# Altium project CWs_RFLink.PrjPcb
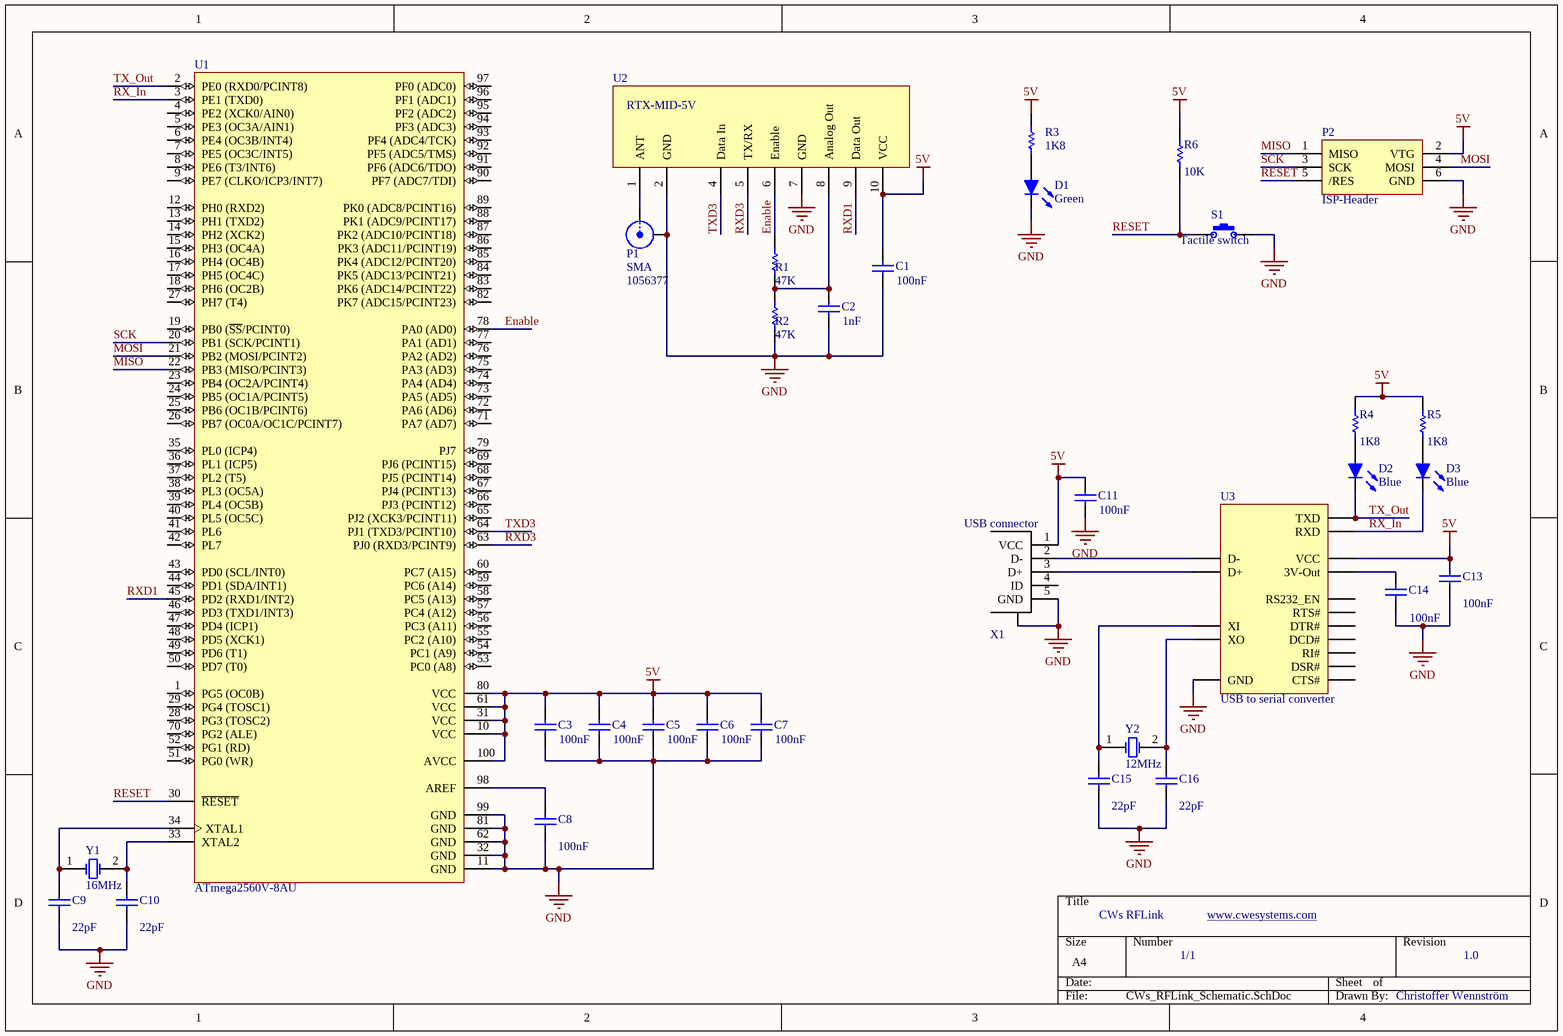
[diagram p0: CWs_RFLink_Schematic.SchDoc]
1 sheet, 33 parts. Net scope: global (net labels, ports and power ports of the same name join across sheets).
Board file: CWs_RFLink_PCB.PcbDoc

## Sheet CWs_RFLink_Schematic.SchDoc
size A4

### Parts
C1  value 100nF  [C-0805]  (hidden comment: Cap)
C2  value 1nF  [C-0805]  (hidden comment: Cap)
C3  value 100nF  [C-0805]  (hidden comment: Cap)
C4  value 100nF  [C-0805]  (hidden comment: Cap)
C5  value 100nF  [C-0805]  (hidden comment: Cap)
C6  value 100nF  [C-0805]  (hidden comment: Cap)
C7  value 100nF  [C-0805]  (hidden comment: Cap)
C8  value 100nF  [C-0805]  (hidden comment: Cap)
C9  value 22pF  [C-0805]  (hidden comment: Cap)
C10  value 22pF  [C-0805]  (hidden comment: Cap)
C11  value 100nF  [C-0805]  (hidden comment: Cap)
C13  value 100nF  [C-0805]  (hidden comment: Cap)
C14  value 100nF  [C-0805]  (hidden comment: Cap)
C15  value 22pF  [C-0805]  (hidden comment: Cap)
C16  value 22pF  [C-0805]  (hidden comment: Cap)
D1  Green  [LED0805]
D2  Blue  [LED0805]
D3  Blue  [LED0805]
P1  SMA  Supplier Part Number 1: 1056377  [SMA]
P2  ISP-Header  [HDR2X3]
R1  value 47K  [res-0805]  (hidden comment: Res1)
R2  value 47K  [res-0805]  (hidden comment: Res1)
R3  value 1K8  [res-0805]  (hidden comment: Res1)
R4  value 1K8  [res-0805]  (hidden comment: Res1)
R5  value 1K8  [res-0805]  (hidden comment: Res1)
R6  value 10K  [res-0805]  (hidden comment: Res1)
S1  Tactile switch  [B3FS-1010]
U1  ATmega2560V-8AU  [100A_N]
U2  RTX-MID-5V  [RTX-MID-5V]  (value not drawn)
U3  USB to serial converter  [SOIC16_M]
X1  USB connector  [USBmicro]
Y1  16MHz  [5032 crystal]
Y2  12MHz  [5032 crystal]

### Nets
5V: C1.2 C3.2 C4.2 C5.2 C6.2 C7.2 C11.2 C13.2 P2.2(VTG) R3.1 R4.2 R5.2 R6.2 U1.10(VCC) U1.31(VCC) U1.61(VCC) U1.80(VCC) U1.100(AVCC) U2.10(VCC) U3.16(VCC) X1.1(VCC)
GND: C1.1 C2.1 C3.1 C4.1 C5.1 C6.1 C7.1 C8.1 C9.1 C10.1 C11.1 C13.1 C14.1 C15.1 C16.1 D1.2(K) P1.2(Y) P2.6(GND) R2.1 S1.2 U1.11(GND) U1.32(GND) U1.62(GND) U1.81(GND) U1.99(GND) U2.2(GND) U2.7(GND) U3.1(GND) X1.5(GND)
Enable: R1.2 U1.78(PA0_(AD0)) U2.6(Enable)
MISO: P2.1(MISO) U1.22(PB3_(MISO/PCINT3))
MOSI: P2.4(MOSI) U1.21(PB2_(MOSI/PCINT2))
RESET: P2.5(/RES) R6.1 S1.1 U1.30(~{RESET})
RX_In: D3.2(K) U1.3(PE1_(TXD0)) U3.3(RXD)
RXD1: U1.45(PD2_(RXD1/INT2)) U2.9(Data_Out)
RXD3: U1.63(PJ0_(RXD3/PCINT9)) U2.5(TX/RX)
SCK: P2.3(SCK) U1.20(PB1_(SCK/PCINT1))
TX_Out: D2.2(K) U1.2(PE0_(RXD0/PCINT8)) U3.2(TXD)
TXD3: U1.64(PJ1_(TXD3/PCINT10)) U2.4(Data_In)
NetC2_2: C2.2 R1.1 R2.2 U2.8(Analog_Out)
NetC8_2: C8.2 U1.98(AREF)
NetC9_2: C9.2 U1.34(XTAL1) Y1.1(OSC1)
NetC10_2: C10.2 U1.33(XTAL2) Y1.2(OSC2)
NetC14_2: C14.2 U3.4(3V-Out)
NetC15_2: C15.2 U3.7(XI) Y2.1(OSC1)
NetC16_2: C16.2 U3.8(XO) Y2.2(OSC2)
NetD1_1: D1.1(A) R3.2
NetD2_1: D2.1(A) R4.1
NetD3_1: D3.1(A) R5.1
NetP1_1: P1.1(X) U2.1(ANT)
NetU3_5: U3.5(D+) X1.3(D+)
NetU3_6: U3.6(D-) X1.2(D-)

Not connected (* = marked no-connect by the designer): U1 1(PG5_(OC0B)) 4(PE2_(XCK0/AIN0)) 5(PE3_(OC3A/AIN1)) 6(PE4_(OC3B/INT4)) 7(PE5_(OC3C/INT5)) 8(PE6_(T3/INT6)) 9(PE7_(CLKO/ICP3/INT7)) 12(PH0_(RXD2)) 13(PH1_(TXD2)) 14(PH2_(XCK2)) 15(PH3_(OC4A)) 16(PH4_(OC4B)) 17(PH5_(OC4C)) 18(PH6_(OC2B)) 19(PB0_(~{SS}/PCINT0)) 23(PB4_(OC2A/PCINT4)) 24(PB5_(OC1A/PCINT5)) 25(PB6_(OC1B/PCINT6)) 26(PB7_(OC0A/OC1C/PCINT7)) 27(PH7_(T4)) 28(PG3_(TOSC2)) 29(PG4_(TOSC1)) 35(PL0_(ICP4)) 36(PL1_(ICP5)) 37(PL2_(T5)) 38(PL3_(OC5A)) 39(PL4_(OC5B)) 40(PL5_(OC5C)) 41(PL6) 42(PL7) 43(PD0_(SCL/INT0)) 44(PD1_(SDA/INT1)) 46(PD3_(TXD1/INT3)) 47(PD4_(ICP1)) 48(PD5_(XCK1)) 49(PD6_(T1)) 50(PD7_(T0)) 51(PG0_(WR)) 52(PG1_(RD)) 53(PC0_(A8)) 54(PC1_(A9)) 55(PC2_(A10)) 56(PC3_(A11)) 57(PC4_(A12)) 58(PC5_(A13)) 59(PC6_(A14)) 60(PC7_(A15)) 65(PJ2_(XCK3/PCINT11)) 66(PJ3_(PCINT12)) 67(PJ4_(PCINT13)) 68(PJ5_(PCINT14)) 69(PJ6_(PCINT15)) 70(PG2_(ALE)) 71(PA7_(AD7)) 72(PA6_(AD6)) 73(PA5_(AD5)) 74(PA4_(AD4)) 75(PA3_(AD3)) 76(PA2_(AD2)) 77(PA1_(AD1)) 79(PJ7) 82(PK7_(ADC15/PCINT23)) 83(PK6_(ADC14/PCINT22)) 84(PK5_(ADC13/PCINT21)) 85(PK4_(ADC12/PCINT20)) 86(PK3_(ADC11/PCINT19)) 87(PK2_(ADC10/PCINT18)) 88(PK1_(ADC9/PCINT17)) 89(PK0_(ADC8/PCINT16)) 90(PF7_(ADC7/TDI)) 91(PF6_(ADC6/TDO)) 92(PF5_(ADC5/TMS)) 93(PF4_(ADC4/TCK)) 94(PF3_(ADC3)) 95(PF2_(ADC2)) 96(PF1_(ADC1)) 97(PF0_(ADC0)); U3 9(CTS#) 10(DSR#) 11(RI#) 12(DCD#) 13(DTR#) 14(RTS#) 15(RS232_EN); X1 4(ID) 6(Shield)

### Notes on the sheet
- CWs RFLink
- www.cwesystems.com <http://www.cwesystems.com>
- 1/1
- 1.0
- Christoffer Wennström

### Library data of the parts
C1-C11 C13-C16 = Cap: Capacitor; Published: 8-Jun-2000; LatestRevisionDate: 17-Jul-2002; LatestRevisionNote: Re-released for DXP Platform.; PackageReference: RAD-0.3; Publisher: Altium Limited; PackageDescription: Radial Cap, Thru-Hole; 2 Leads; 0.3 in Pin Spacing
D1-D3 = LED: Published: 8-Jun-2000; LatestRevisionDate: 08-Jul-2005; LatestRevisionNote: Mech Layer 1 removed.; PackageReference: LED-0; Publisher: Altium Limited; PackageDescription: LED; 2 Leads; Supplier 1: Farnell; Supplier 2: Farnell; Supplier 3: Farnell
P1 = SMA: SMA Rak kontakt; LatestRevisionDate: 17-Jul-2002; LatestRevisionNote: Re-released for DXP Platform.; Publisher: Altium Limited; Supplier 1: Farnell
P2 = ISP-Header: Header, 3-Pin, Dual row; LatestRevisionDate: 17-Jul-2002; LatestRevisionNote: Re-released for DXP Platform.; Publisher: Altium Limited
R1-R6 = Res1: Resistor; Published: 8-Jun-2000; LatestRevisionDate: 17-Jul-2002; LatestRevisionNote: Re-released for DXP Platform.; PackageReference: AXIAL-0.3; Publisher: Altium Limited; PackageDescription: Axial Device, Thru-Hole; 2 Leads; 0.3 in Pin Spacing
U1 = ATmega2560V-8AU: 8-bit AVR Microcontroller, 1.8-5.5V, 2MHz, 256KB Flash, 4KB EEPROM, 8KB SRAM, 86 GPIO pins, 100-pin TQFP, Industrial Grade (-40°C to 85°C), Pb-Free; DatasheetVersion: revN, May-2011; PackageVersion: revD, Oct-2010; PackageReference: 100A; PackageDescription: 100-Pin Thin Profile Plastic Quad Flat Pack (TQFP), 14 x 14 x 1.0 mm Body, 0.5 mm Pitch; Code_JEDEC: MS-026-AED; ComponentLink1Description: Manufacturer URL; ComponentLink1URL: http://www.atmel.com/; ComponentLink2Description: ATmega640/1280/1281/2560/2561 Datasheet; ComponentLink2URL: http://www.atmel.com/dyn/resources/prod_documents/doc2549.pdf; ComponentLink3Description: ATmega640/1280/1281/2560/2561 Summary; ComponentLink3URL: http://www.atmel.com/dyn/resources/prod_documents/2549S.pdf
U2 = RTX-MID-5V: Aurel RTX-MID-5V
U3 = CH340G
X1 = USB_connector
Y1 Y2 = Kristall: Crystal Oscillator; Published: 17-Jul-2002; DatasheetDocument: 18-Apr-2000; PackageReference: HC-49U; Publisher: Altium Limited; ComponentLink1Description: Manufacturer Link; ComponentLink1URL: http://www.ecsxtal.com/; ComponentLink2Description: Datasheet; ComponentLink2URL: http://www.ecsxtal.com/pdf2/HC49U.PDF
S1 = Tactile switch: Supplier 1: Farnell; Supplier 2: Farnell; Supplier 3: Farnell